# EAGLE design main_indoor_sensor_v0.2 (EAGLE 6.5.0)
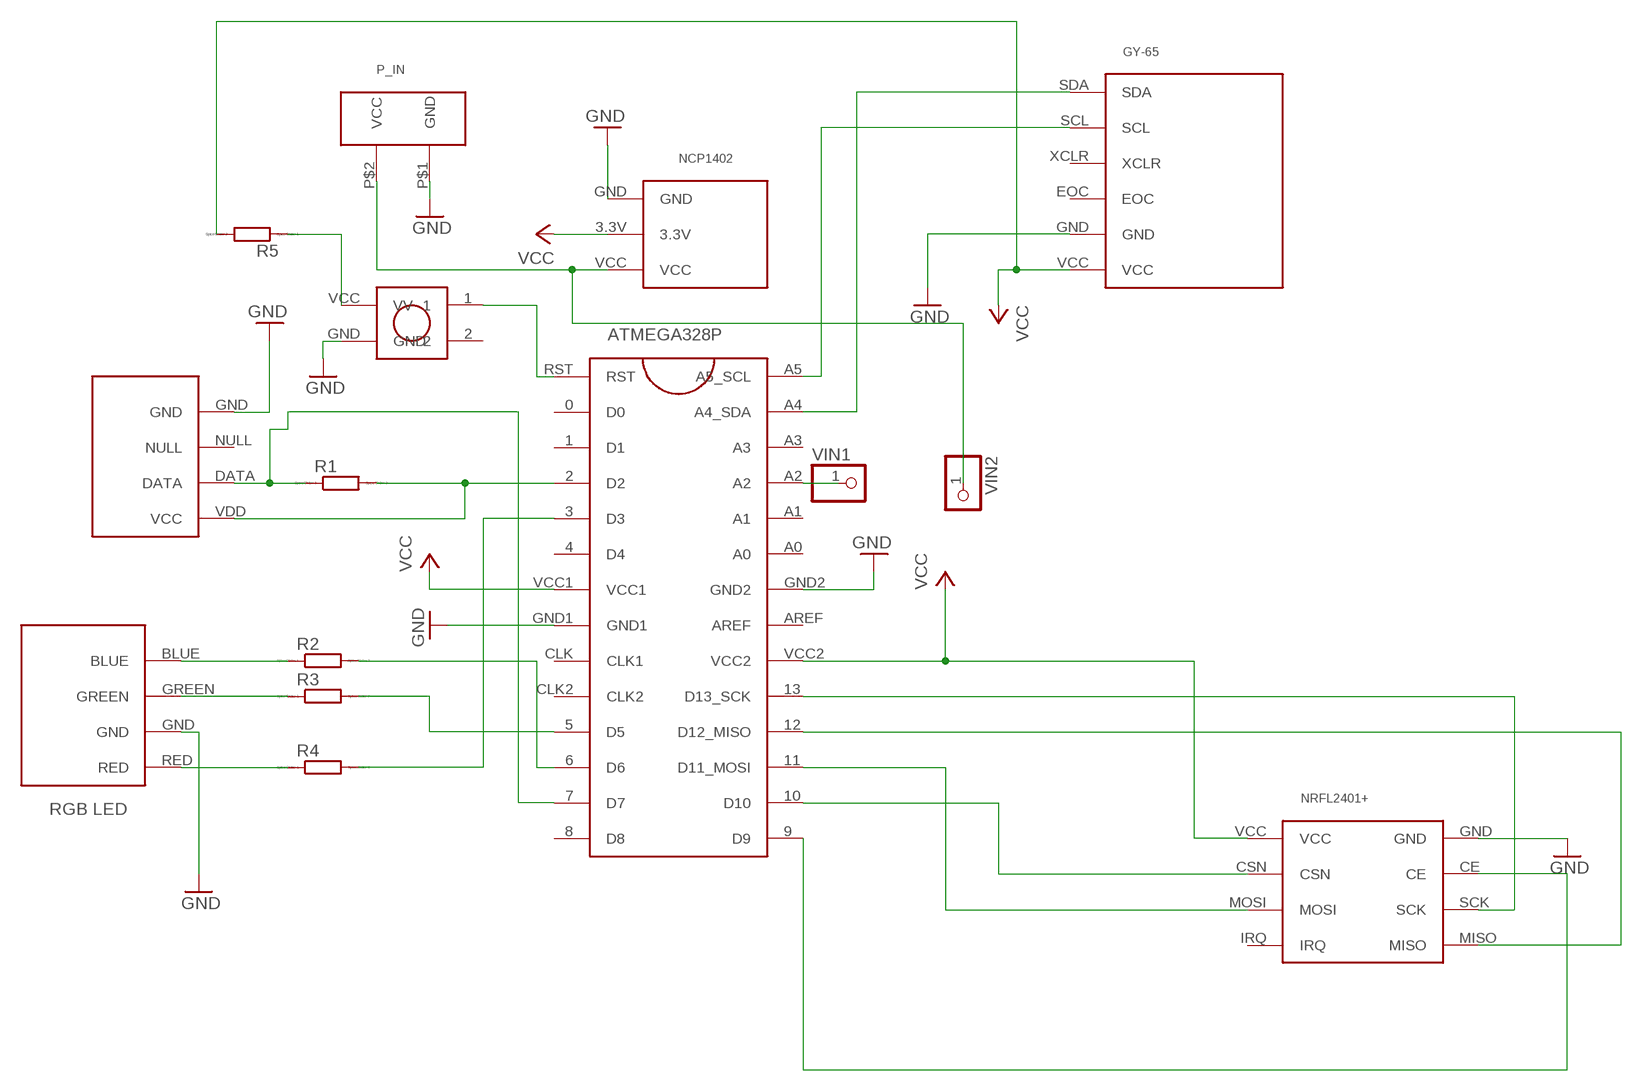
[diagram p0: schematic, sheet 1]

## Parts
GY-65  GY-65  [GY_65]
NCP1402  NCP1402SPARKFUN  [NCP1402]
NRFL2401+  NRFL24L01_8P  [NRF24L01_10P]
P_IN  2PINCONNECTORSIMPLE  [2PINCONNECTOR]
R1  R0204/7  [0204/7]
R2  R0204/7  [0204/7]
R3  R0204/7  [0204/7]
R4  R0204/7  [0204/7]
R5  R0204/7  [0204/7]
U$1  ATMEGA328PARDUINO  [ATMEGA328P]
U$2  KRS_0612_OK  [KRS0612_RIGHT]
U$3  DHT22WHITE  [DHT22]
U$6  RGB_LED5MM  [RGB_LED]
VIN1  PINHD-1X1  [1X01]
VIN2  PINHD-1X1  [1X01]

## Nets
GND: GY-65.GND NCP1402.GND NRFL2401+.GND P_IN.P$1(GND) U$1.GND1 U$1.GND2 U$2.GND U$3.GND U$6.GND
N$1: GY-65.SDA U$1.A4(A4_SDA)
N$2: GY-65.SCL U$1.A5(A5_SCL)
N$3: NRFL2401+.SCK U$1.13(D13_SCK)
N$4: NRFL2401+.MISO U$1.12(D12_MISO)
N$5: NRFL2401+.MOSI U$1.11(D11_MOSI)
N$6: R1.2 U$1.2(D2) U$3.VDD(VCC)
N$7: R1.1 U$1.7(D7) U$3.DATA
N$8: R4.2 U$1.3(D3)
N$9: R2.1 U$6.BLUE
N$10: R3.1 U$6.GREEN
N$11: R2.2 U$1.6(D6)
N$12: R3.2 U$1.5(D5)
N$13: R4.1 U$6.RED
N$14: NRFL2401+.CSN U$1.10(D10)
N$15: NRFL2401+.CE U$1.9(D9)
N$16: U$1.RST U$2.1
N$17: NCP1402.VCC P_IN.P$2(VCC) VIN2.1
N$19: R5.1 U$2.VCC(VV)
N$20: U$1.A2 VIN1.1
VCC: GY-65.VCC NCP1402.3.3V NRFL2401+.VCC R5.2 U$1.VCC1 U$1.VCC2
Unconnected: GY-65.EOC GY-65.XCLR NRFL2401+.IRQ U$1.0(D0) U$1.1(D1) U$1.4(D4) U$1.8(D8) U$1.A0 U$1.A1 U$1.A3 U$1.AREF U$1.CLK2 U$1.CLK(CLK1) U$2.2 U$3.NULL

## Library data of the parts
GY-65 = piweather:GY-65
NCP1402 = piweather:NCP1402
NRFL2401+ = piweather:NRFL24L01_8P
P_IN = piweather:2PINCONNECTOR
R1-R5 = eagle-ltspice:R: RESISTOR, European symbol; SPICEMODEL: NONE; SPICEPREFIX: R
U$1 = piweather:ATMEGA328P
U$2 = piweather:KRS_0612_OK
U$3 = piweather:DHT22
U$6 = piweather:RGB_LED
VIN1 VIN2 = pinhead:PINHD-1X1: PIN HEADER

## Board
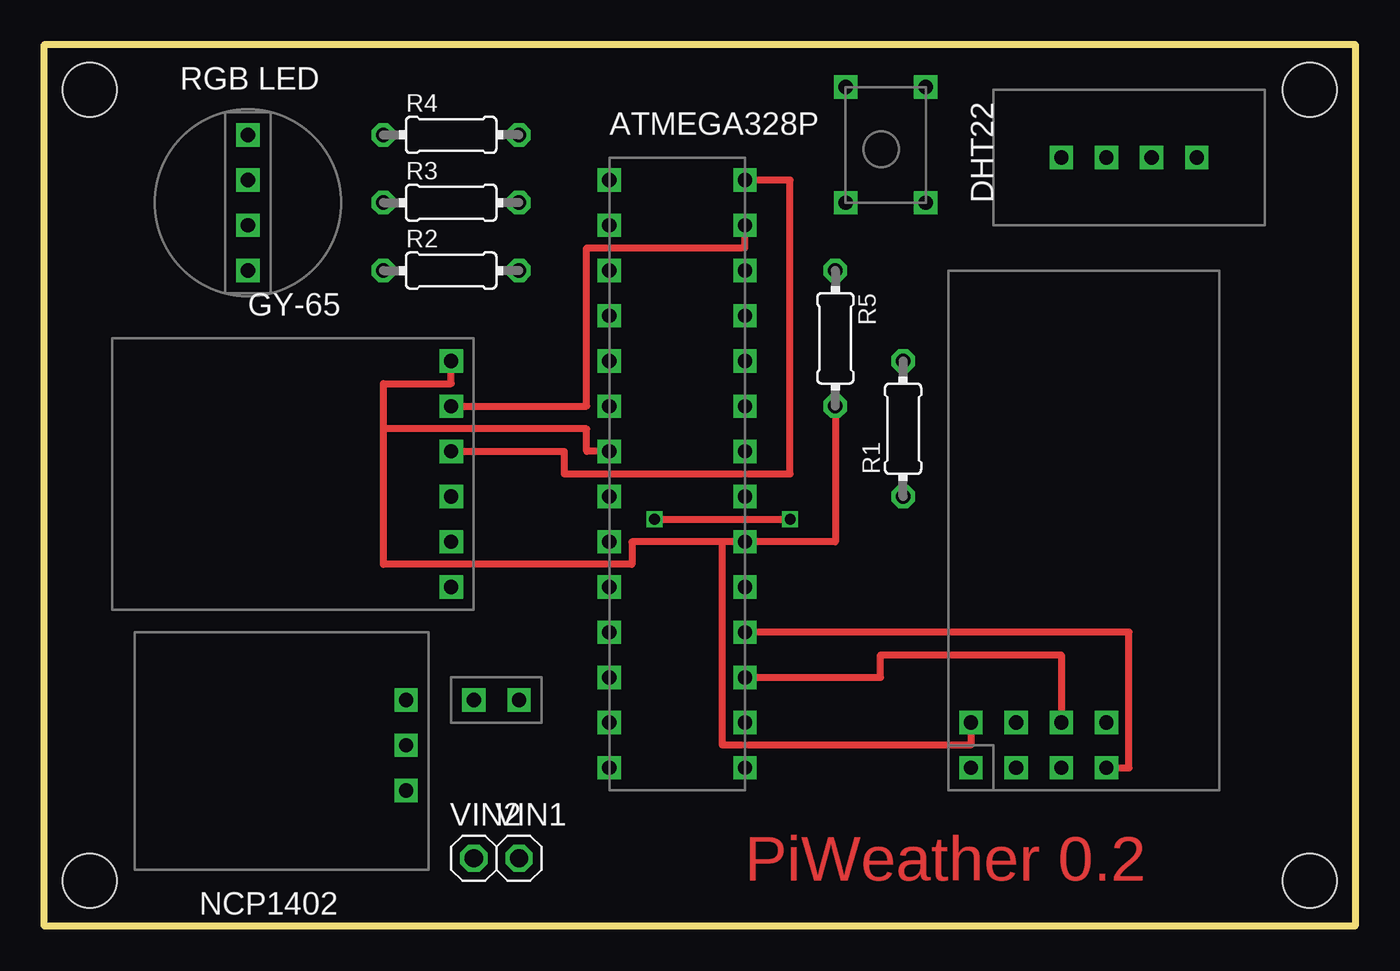
[diagram p1: board, top side]
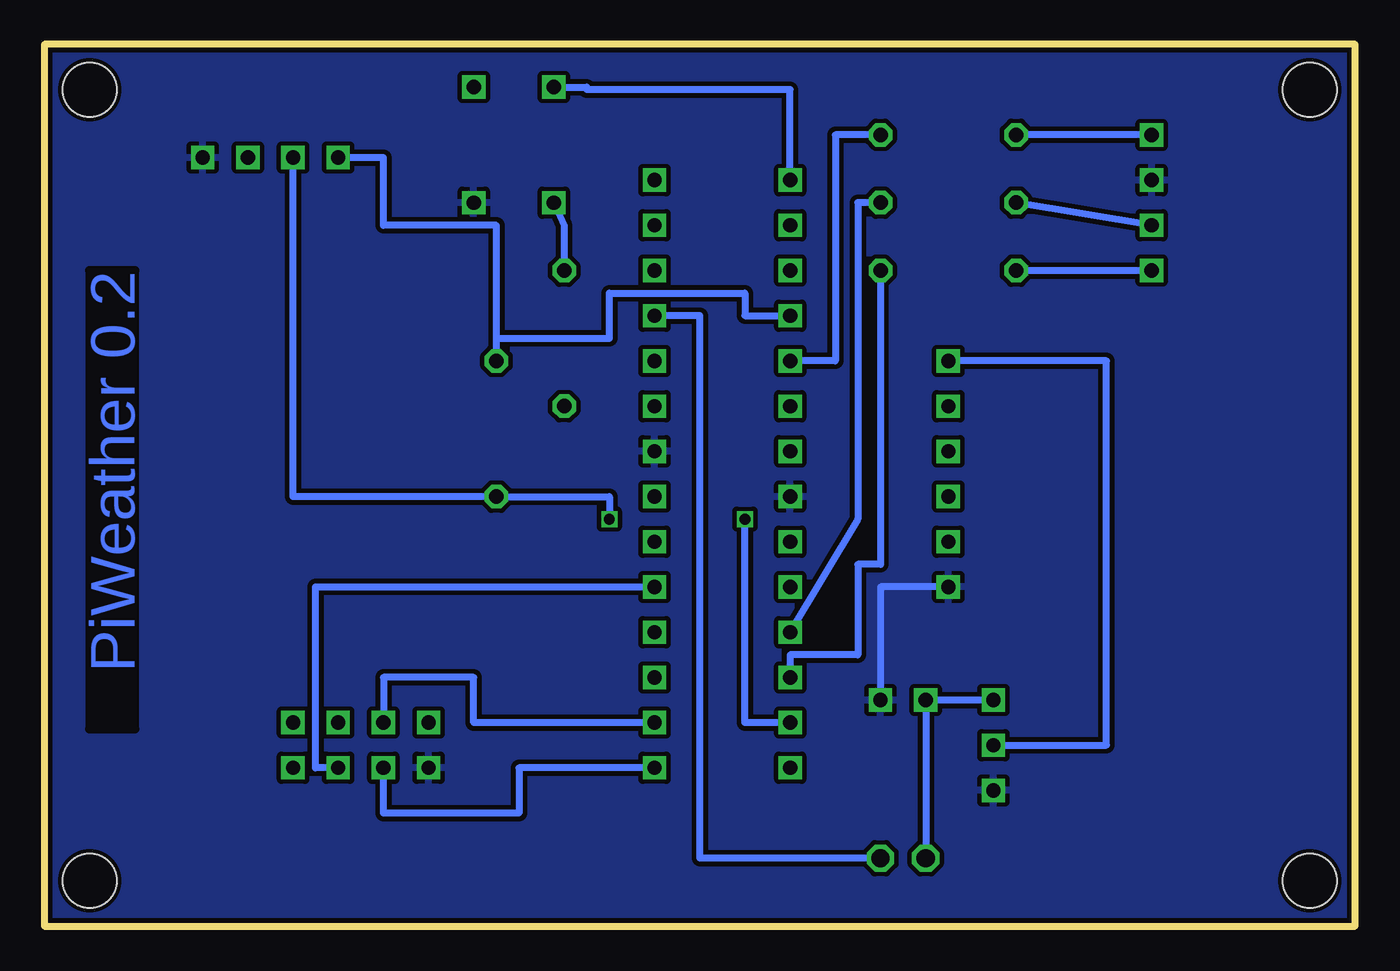
[diagram p2: board, bottom side, seen from below]

Size 73.66 x 49.53 mm. Coordinates in mm from the lower left corner, seen from the top.
Outline: 0,49.53 73.66,49.53 73.66,0 0,0 0,49.53
Copper layers (1*16): Top 0.035mm / dielectric 1.5mm / Bottom 0.035mm
Design rules "SeeedStudio_2layer_DRU_no_angle_20140221": minimum track width 6mil, minimum drill 12mil, track to track 6mil, track to pad 6mil, pad to pad 6mil, via to via 6mil, smd to smd 0mil, copper to edge 10mil, drill to drill 10mil, minimum pad ring 10mil, minimum via ring 6mil, stop-mask expansion 2mil, vias tented up to drill 100mil, thermal gap 10mil
Holes 3.05 mm at 2.54,46.99 71.12,46.99 2.54,2.54 71.12,2.54

### Footprints (pad centres in the part's own frame; a part is rotated, then mirrored left to right if it is on the bottom)
GY_65 = drill 0.8 square: EOC 5.08,-3.81; GND 5.08,-6.35; SCL 5.08,1.27; SDA 5.08,3.81; VCC 5.08,6.35; XCLR 5.08,-1.27
NCP1402 = drill 0.8 square: 3.3V -2.54,-0.635; GND -2.54,1.905; VCC -2.54,-3.175
NRF24L01_10P = drill 0.8 square: CE -3.81,2.54; CSN -1.27,2.54; GND -3.81,5.08; IRQ -1.27,-2.54; MISO -3.81,-2.54; MOSI -1.27,0; SCK -3.81,0; VCC -1.27,5.08
2PINCONNECTOR = drill 0.8 square: P$1 -1.27,0; P$2 1.27,0
0204/7 = drill 0.813 octagon: 1 -3.81,0; 2 3.81,0
ATMEGA328P = drill 0.8 square: 0 -3.81,11.43; 1 -3.81,8.89; 2 -3.81,6.35; 3 -3.81,3.81; 4 -3.81,1.27; 5 -3.81,-11.43; 6 -3.81,-13.97; 7 -3.81,-16.51; 8 -3.81,-19.05; 9 3.81,-19.05; 10 3.81,-16.51; 11 3.81,-13.97; 12 3.81,-11.43; 13 3.81,-8.89; A0 3.81,1.27; A1 3.81,3.81; A2 3.81,6.35; A3 3.81,8.89; A4 3.81,11.43; A5 3.81,13.97; AREF 3.81,-3.81; CLK -3.81,-6.35; CLK2 -3.81,-8.89; GND1 -3.81,-3.81; GND2 3.81,-1.27; RST -3.81,13.97; VCC1 -3.81,-1.27; VCC2 3.81,-6.35
KRS0612_RIGHT = drill 0.8 square: 1 6.5,4.5; 2 6.5,0; GND 0,0; VCC 0,4.5
DHT22 = drill 0.8 square: DATA -2.54,5.08; GND -2.54,0; NULL -2.54,2.54; VDD -2.54,7.62
RGB_LED = drill 0.8 square: BLUE 0,-3.81; GND 0,1.27; GREEN 0,-1.27; RED 0,3.81
1X01 = drill 1.016 octagon: 1 0,0

### Placement (x,y rotation side)
GY-65  17.78,25.4 0 top
NCP1402  17.78,9.53 180 top
NRFL2401+  57.15,12.7 90 top
P_IN  25.4,12.7 180 top
R1  48.26,27.94 90 top
R2  22.86,36.83 0 top
R3  22.86,40.64 0 top
R4  22.86,44.45 0 top
R5  44.45,33.02 270 top
U$1  35.56,27.94 0 top
U$2  49.53,40.64 90 top
U$3  64.77,45.72 90 top
U$6  11.43,40.64 0 top
VIN1  26.67,3.81 0 top
VIN2  24.13,3.81 0 top

### Tracks (layer width: path | path; a pad name or v marks a point on that pad's centre or on a via)
GND
  Bottom 0.406: GY-65.GND 26.67,19.05 P_IN.P$1
  pour Bottom (isolate 0.254): 0,0 73.66,0 73.66,49.53 0,49.53
N$1
  Top 0.406: GY-65.SDA 30.48,29.21 30.48,38.1 39.37,38.1 U$1.A4
N$2
  Top 0.406: GY-65.SCL 29.21,26.67 29.21,25.4 41.91,25.4 41.91,41.91 U$1.A5
N$3
  Bottom 0.406: U$1.13 58.42,19.05 58.42,8.89 NRFL2401+.SCK
N$4
  Top 0.406: NRFL2401+.MISO 60.96,8.89 60.96,16.51 U$1.12
N$5
  Top 0.406: U$1.11 46.99,13.97 46.99,15.24 57.15,15.24 NRFL2401+.MOSI
N$6
  Bottom 0.406: R1.2 48.26,33.02 | 48.26,33.02 41.91,33.02 41.91,35.56 34.29,35.56 34.29,34.29 U$1.2 | 48.26,33.02 48.26,39.37 54.61,39.37 54.61,43.18 U$3.VDD
N$7  (via drill 0.6)
  Top 0.406: v34.29,22.86 v41.91,22.86
  Bottom 0.406: U$3.DATA 59.69,24.13 R1.1 41.91,24.13 v41.91,22.86 | U$1.7 34.29,11.43 v34.29,22.86
N$8
  Bottom 0.406: R4.2 29.21,44.45 29.21,31.75 U$1.3
N$9
  Bottom 0.406: U$6.BLUE R2.1
N$10
  Bottom 0.406: U$6.GREEN R3.1
N$11
  Bottom 0.406: R2.2 26.67,20.32 27.94,20.32 27.94,15.24 31.75,15.24 U$1.6
N$12
  Bottom 0.406: R3.2 27.94,40.64 27.94,22.86 U$1.5
N$13
  Bottom 0.406: U$6.RED R4.1
N$14
  Bottom 0.406: U$1.10 49.53,11.43 49.53,13.97 54.61,13.97 NRFL2401+.CSN
N$15
  Bottom 0.406: U$1.9 46.99,8.89 46.99,6.35 54.61,6.35 NRFL2401+.CE
N$16
  Bottom 0.406: U$1.RST 31.75,46.99 43.18,46.99 43.18,47.14 U$2.1
N$17
  Bottom 0.406: NCP1402.VCC P_IN.P$2 VIN2.1
N$19
  Bottom 0.406: U$2.VCC 44.45,39.37 R5.1
N$20
  Bottom 0.406: VIN1.1 36.83,3.81 36.83,34.29 U$1.A2
VCC
  Top 0.406: R5.2 44.45,21.59 U$1.VCC2 38.1,21.59 | 38.1,21.59 33.02,21.59 33.02,20.32 19.05,20.32 19.05,27.94 | 19.05,27.94 19.05,30.48 22.86,30.48 GY-65.VCC | U$1.VCC1 30.48,26.67 30.48,27.94 19.05,27.94 | NRFL2401+.VCC 52.07,10.16 38.1,10.16 38.1,21.59
  Bottom 0.406: NCP1402.3.3V 13.97,10.16 13.97,31.75 GY-65.VCC

### Text on the board
Top: PiWeather 0.2
Bottom: PiWeather 0.2